# EAGLE design d1-relay-module-shield (EAGLE 9.6.2)
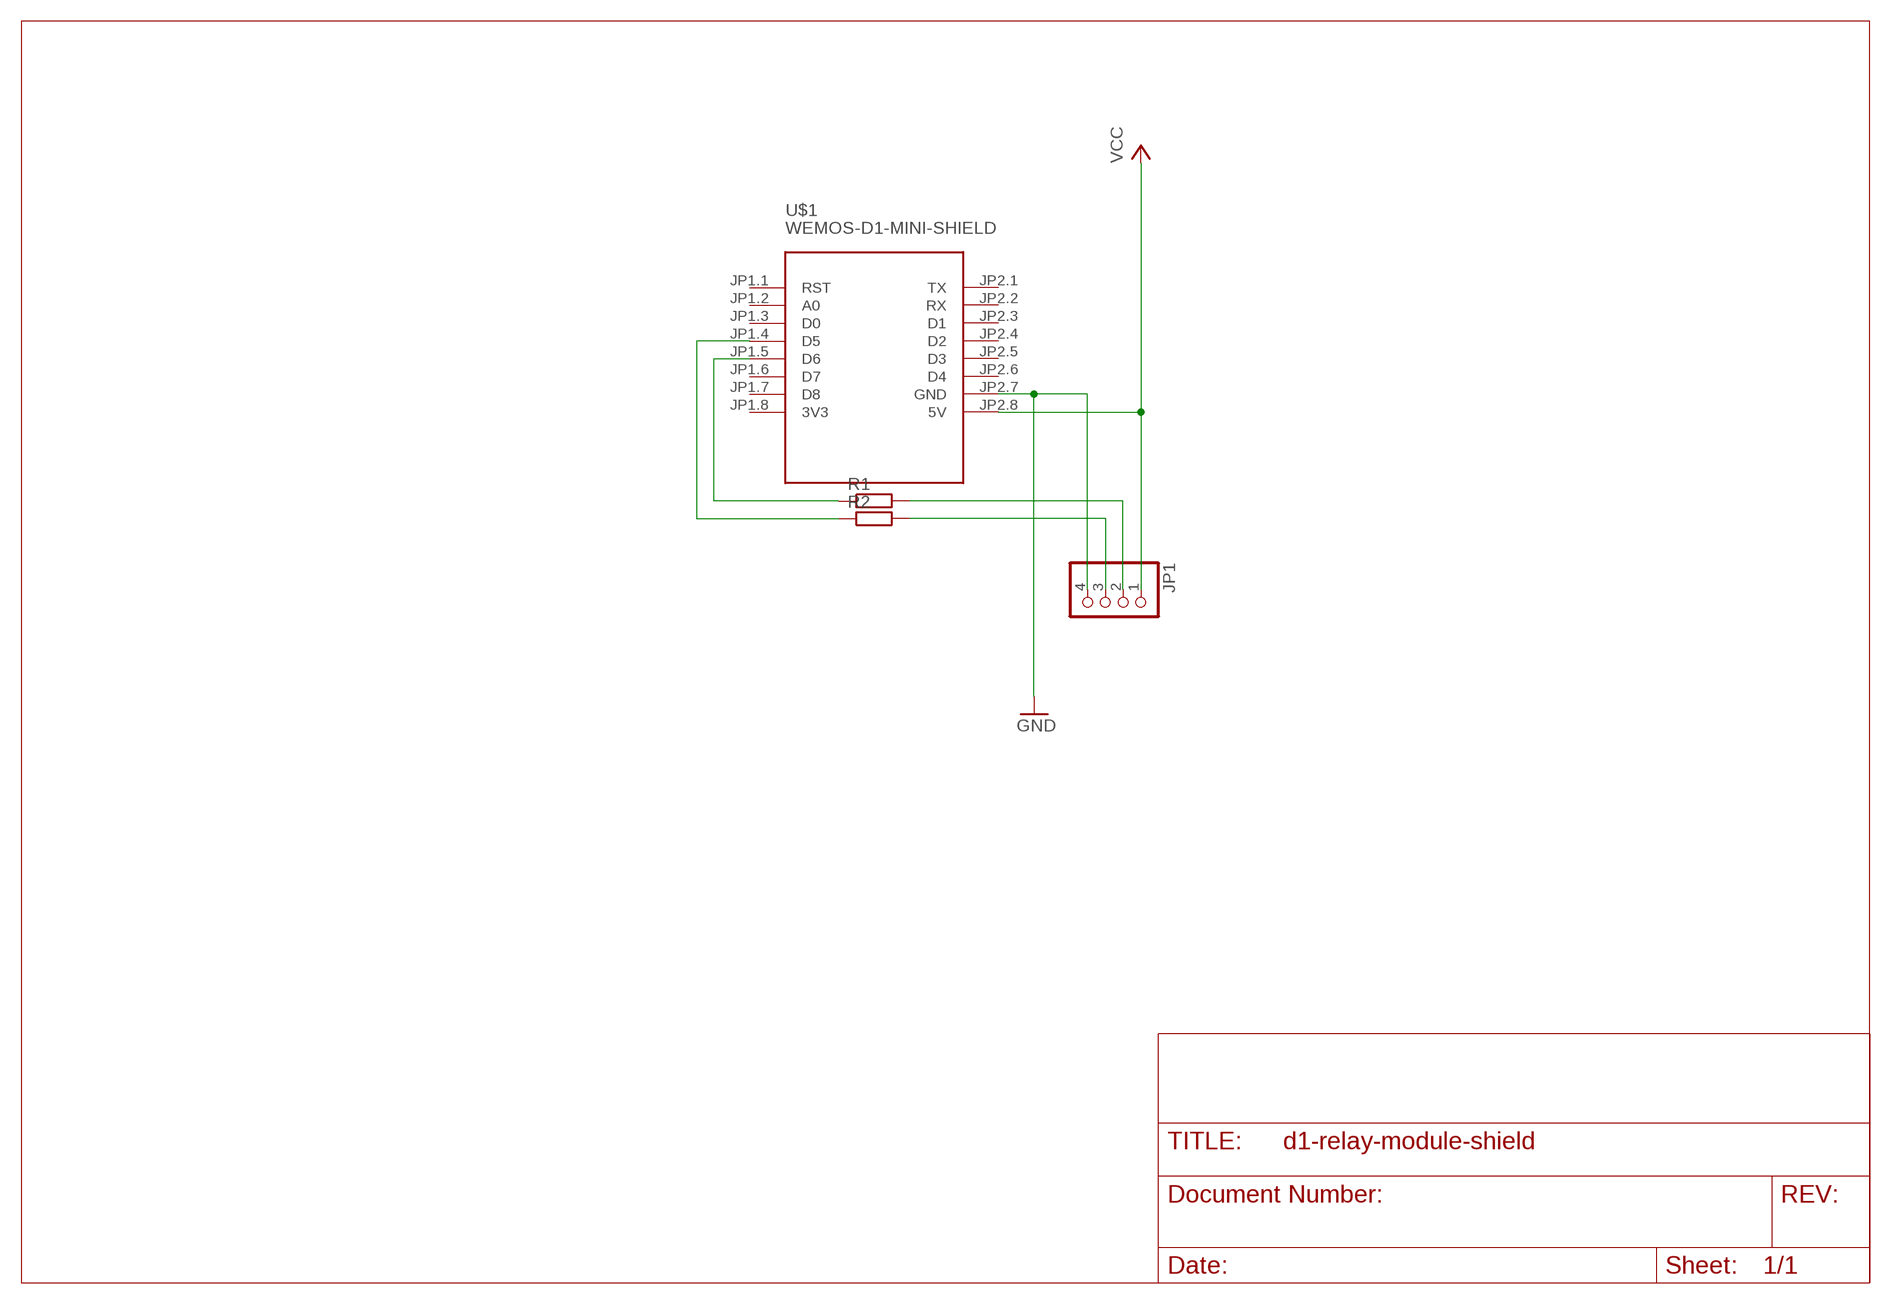
[diagram p0: schematic, sheet 1]

## Parts
JP1  PINHD-1X4  [1X04]
R1  R-EU_R0603  [R0603]
R2  R-EU_R0603  [R0603]
U$1  WEMOS-D1-MINI-SHIELD  [WEMOS-D1-MINI-SHIELD]

## Nets
GND: JP1.4 U$1.JP2.7(GND)
N$1: JP1.2 R1.2
N$2: JP1.3 R2.2
N$3: R1.1 U$1.JP1.5(D6)
N$4: R2.1 U$1.JP1.4(D5)
VCC: JP1.1 U$1.JP2.8(5V)
Unconnected: U$1.JP1.1(RST) U$1.JP1.2(A0) U$1.JP1.3(D0) U$1.JP1.6(D7) U$1.JP1.7(D8) U$1.JP2.1(TX) U$1.JP2.2(RX) U$1.JP2.3(D1) U$1.JP2.4(D2) U$1.JP2.5(D3) U$1.JP2.6(D4)

## Power pins joined to a net without a drawn wire
3V3: U$1.JP1.8(3V3)

## Library data of the parts
JP1 = pinhead:PINHD-1X4: PIN HEADER
R1 R2 = rcl:R-EU_: RESISTOR, European symbol; SPICEPREFIX: R
U$1 = diy-modules:WEMOS-D1-MINI-SHIELD: Template for WEMOS D1 mini compatible shields NOTICE: This is a template only. You can use it as a base to create symbols for WEMOS D1 mini compatible shields. Official list of available shields can be found here: https://www.wemos.cc/D1-mini-Shields

## Board
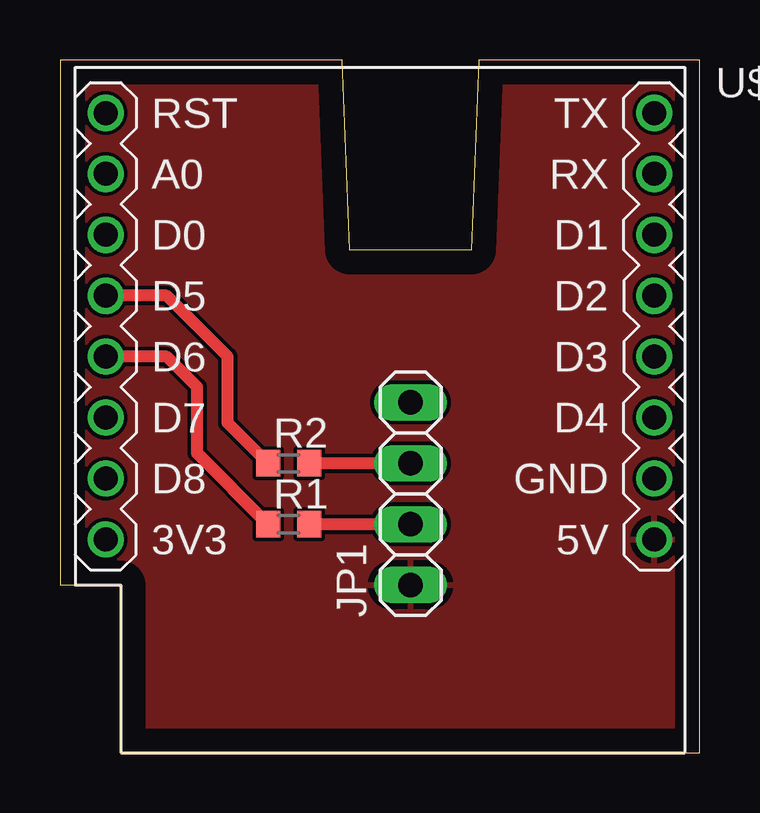
[diagram p1: board, top side]
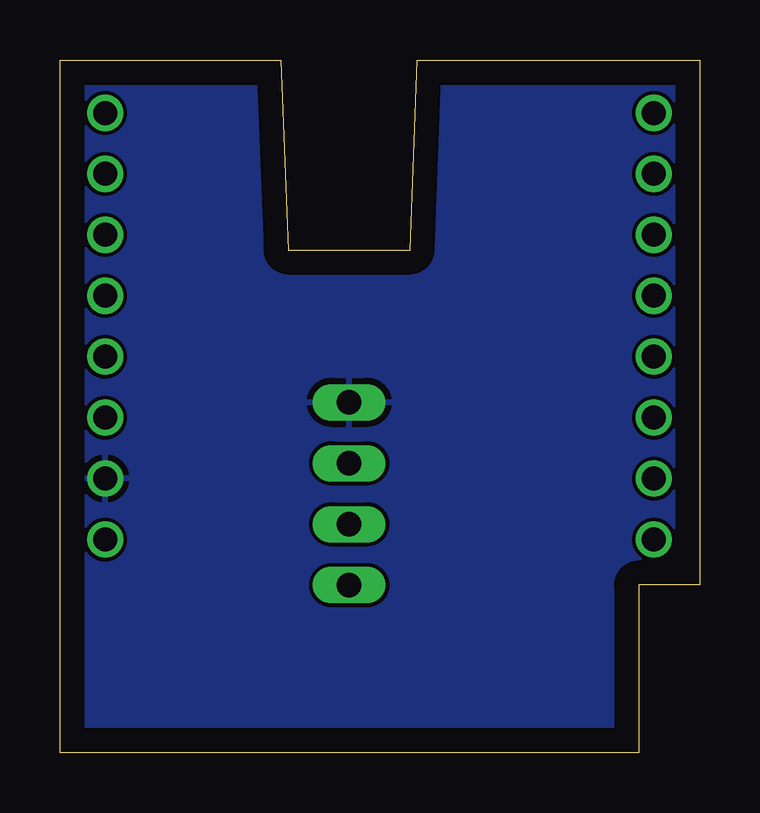
[diagram p2: board, bottom side, seen from below]

Size 26.65 x 28.88 mm. Coordinates in mm from the lower left corner, seen from the top.
Outline: 2.54,0 26.65,0 26.65,28.88 17.45,28.88 17.14,20.95 12.06,20.95 11.76,28.88 0,28.88 0,6.99 2.54,6.99 2.54,0
Copper layers (1*16): Top 0.035mm / dielectric 1.5mm / Bottom 0.035mm
Design rules "default": minimum track width 6mil, minimum drill 0.35mm, track to track 6mil, track to pad 6mil, pad to pad 6mil, via to via 6mil, smd to smd 6mil, copper to edge 40mil, drill to drill 6mil, minimum pad ring 10mil, minimum via ring 8mil, stop-mask expansion 4mil, vias tented up to drill 0mil, thermal gap 10mil

### Footprints (pad centres in the part's own frame; a part is rotated, then mirrored left to right if it is on the bottom)
1X04 = drill 1.016 long: 1 -3.81,0; 2 -1.27,0; 3 1.27,0; 4 3.81,0
R0603 = smd 1 x 1.1: 1 -0.85,0; 2 0.85,0
WEMOS-D1-MINI-SHIELD = drill 1: JP1.1 -11.43,12.065; JP1.2 -11.43,9.525; JP1.3 -11.43,6.985; JP1.4 -11.43,4.445; JP1.5 -11.43,1.905; JP1.6 -11.43,-0.635; JP1.7 -11.43,-3.175; JP1.8 -11.43,-5.715; JP2.1 11.43,12.065; JP2.2 11.43,9.525; JP2.3 11.43,6.985; JP2.4 11.43,4.445; JP2.5 11.43,1.905; JP2.6 11.43,-0.635; JP2.7 11.43,-3.175; JP2.8 11.43,-5.715

### Placement (x,y rotation side)
JP1  14.61,10.79 90 top
R1  9.53,9.53 0 top
R2  9.53,12.06 0 top
U$1  13.34,14.61 0 top

### Tracks (layer width: path | path; a pad name or v marks a point on that pad's centre or on a via)
GND
  pour Bottom: 0.64,28.57 0.64,6.99 2.54,6.99 2.54,0 26.04,0 26.04,28.57
N$1
  Top 0.508: JP1.2 R1.2
N$2
  Top 0.508: JP1.3 R2.2
N$3
  Top 0.508: R1.1 5.71,12.48 5.71,15.24 4.45,16.51 U$1.JP1.5
N$4
  Top 0.508: R2.1 6.99,13.76 6.99,16.51 4.45,19.05 U$1.JP1.4
VCC
  pour Top: 0.64,28.57 0.64,6.99 2.54,6.99 2.54,0 26.04,0 26.04,28.57